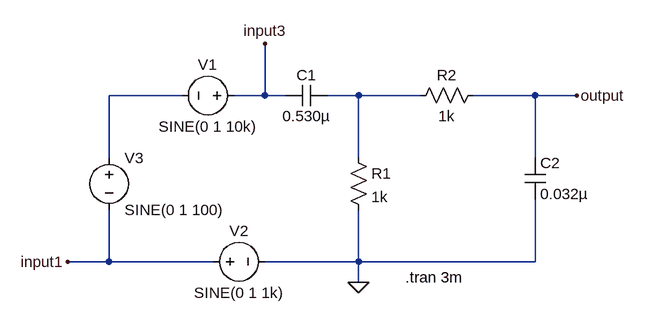
[diagram p0: schematic band-pass-analysis.asc]
band-pass-analysis.asc, the LTspice schematic file:
Version 4
SHEET 1 880 680
WIRE -64 32 -176 32
WIRE 64 32 64 -48
WIRE 64 32 16 32
WIRE 96 32 64 32
WIRE 208 32 160 32
WIRE 304 32 208 32
WIRE 480 32 384 32
WIRE 544 32 480 32
WIRE -176 128 -176 32
WIRE 208 128 208 32
WIRE 480 128 480 32
WIRE -176 288 -176 208
WIRE -176 288 -240 288
WIRE -16 288 -176 288
WIRE 208 288 208 208
WIRE 208 288 64 288
WIRE 480 288 480 192
WIRE 480 288 208 288
WIRE 208 320 208 288
FLAG 208 320 0
FLAG 544 32 output
FLAG -240 288 input1
FLAG 64 -48 input3
SYMBOL cap 160 16 R90
WINDOW 0 0 32 VBottom 2
WINDOW 3 32 32 VTop 2
SYMATTR InstName C1
SYMATTR Value 0.530µ
SYMBOL res 192 112 R0
SYMATTR InstName R1
SYMATTR Value 1k
SYMBOL res 400 16 R90
WINDOW 0 0 56 VBottom 2
WINDOW 3 32 56 VTop 2
SYMATTR InstName R2
SYMATTR Value 1k
SYMBOL cap 464 128 R0
SYMATTR InstName C2
SYMATTR Value 0.032µ
SYMBOL voltage 32 32 R90
WINDOW 0 -32 56 VBottom 2
WINDOW 3 32 56 VTop 2
WINDOW 123 0 0 Left 0
WINDOW 39 0 0 Left 0
SYMATTR InstName V1
SYMATTR Value SINE(0 1 10k)
SYMBOL voltage -32 288 R270
WINDOW 0 32 56 VTop 2
WINDOW 3 -32 56 VBottom 2
WINDOW 123 0 0 Left 0
WINDOW 39 0 0 Left 0
SYMATTR InstName V2
SYMATTR Value SINE(0 1 1k)
SYMBOL voltage -176 112 R0
WINDOW 123 0 0 Left 0
WINDOW 39 0 0 Left 0
SYMATTR InstName V3
SYMATTR Value SINE(0 1 100)
TEXT 280 312 Left 2 !.tran 3m

The netlist it stands for:
* band-pass-analysis.asc
C1 N002 input3 0.530µ
R1 N002 0 1k
R2 output N002 1k
C2 output 0 0.032µ
V1 input3 N001 SINE(0 1 10k)
V2 input1 0 SINE(0 1 1k)
V3 N001 input1 SINE(0 1 100)
.tran 3m
.backanno
.end